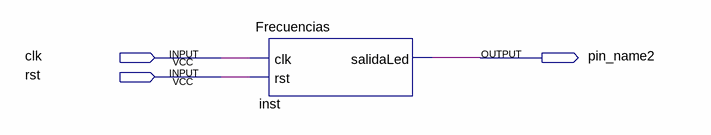
[diagram p0: schematic sheet]
// Quartus schematic practica2.bdf as structural Verilog: 1 symbols, 3 pins
module practica2 (
  input  clk,
  input  rst,
  output pin_name2
);

  Frecuencias inst (.clk(clk), .rst(rst), .salidaLed(pin_name2));
endmodule
